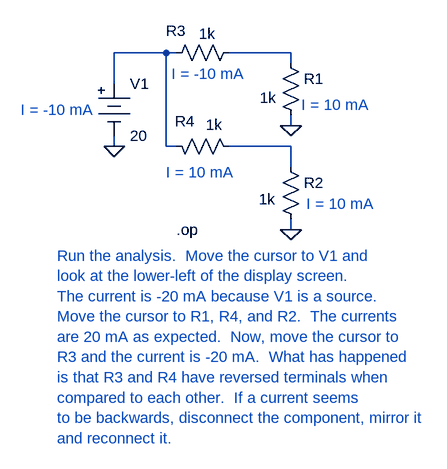
[diagram p0: schematic ConfusingCurrents.asc]
ConfusingCurrents.asc, the LTspice schematic file:
Version 4
SHEET 1 880 680
WIRE -80 -96 -160 -96
WIRE -64 -96 -80 -96
WIRE 112 -96 16 -96
WIRE 112 -80 112 -96
WIRE -160 -48 -160 -96
WIRE 112 16 112 0
WIRE -160 48 -160 32
WIRE -80 48 -80 -96
WIRE -64 48 -80 48
WIRE 112 48 16 48
WIRE 112 80 112 48
WIRE 112 176 112 160
FLAG 112 16 0
FLAG 112 176 0
FLAG -160 48 0
SYMBOL Misc\\battery -160 -64 R0
WINDOW 123 0 0 Left 0
WINDOW 39 0 0 Left 0
SYMATTR InstName V1
SYMATTR Value 20
SYMBOL res 96 -96 R0
WINDOW 3 -32 69 Left 0
SYMATTR InstName R1
SYMATTR Value 1k
SYMBOL res 96 64 R0
WINDOW 3 -33 65 Left 0
SYMATTR InstName R2
SYMATTR Value 1k
SYMBOL res 32 -112 R90
WINDOW 0 -2 97 VBottom 0
WINDOW 3 -29 49 VTop 0
SYMATTR InstName R3
SYMATTR Value 1k
SYMBOL res -80 32 M90
WINDOW 0 -7 29 VBottom 0
WINDOW 3 -33 74 VTop 0
SYMATTR InstName R4
SYMATTR Value 1k
TEXT -64 176 Left 0 !.op
TEXT -248 216 Left 0 ;Run the analysis.  Move the cursor to V1 and \nlook at the lower-left of the display screen.\nThe current is -20 mA because V1 is a source.\nMove the cursor to R1, R4, and R2.  The currents\nare 20 mA as expected.  Now, move the cursor to\nR3 and the current is -20 mA.  What has happened\nis that R3 and R4 have reversed terminals when\ncompared to each other.  If a current seems\nto be backwards, disconnect the component, mirror it\nand reconnect it.
TEXT -72 -64 Left 0 ;I = -10 mA
TEXT 128 -16 Left 0 ;I = 10 mA
TEXT -304 -8 Left 0 ;I = -10 mA
TEXT 136 136 Left 0 ;I = 10 mA
TEXT -80 88 Left 0 ;I = 10 mA

The netlist it stands for:
* ConfusingCurrents.asc
V1 N001 0 20
R1 N002 0 1k
R2 N003 0 1k
R3 N002 N001 1k
R4 N001 N003 1k
.op
* Run the analysis.  Move the cursor to V1 and
* look at the lower-left of the display screen.
* The current is -20 mA because V1 is a source.
* Move the cursor to R1, R4, and R2.  The currents
* are 20 mA as expected.  Now, move the cursor to
* R3 and the current is -20 mA.  What has happened
* is that R3 and R4 have reversed terminals when
* compared to each other.  If a current seems
* to be backwards, disconnect the component, mirror it
* and reconnect it.
* I = -10 mA
* I = 10 mA
* I = -10 mA
* I = 10 mA
* I = 10 mA
.backanno
.end